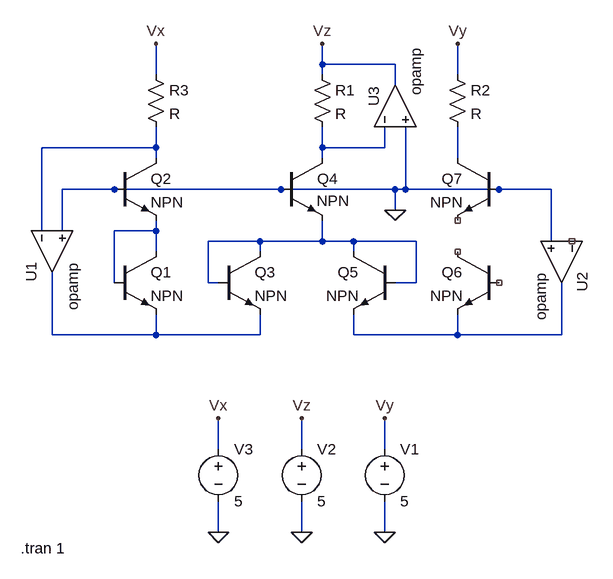
[diagram p0: schematic Draft1.asc]
Draft1.asc, the LTspice schematic file:
Version 4
SHEET 1 1040 680
WIRE 384 -240 384 -272
WIRE 496 -240 384 -240
WIRE 128 -224 128 -272
WIRE 384 -224 384 -240
WIRE 592 -224 592 -272
WIRE 496 -208 496 -240
WIRE 128 -112 128 -144
WIRE 128 -112 -48 -112
WIRE 384 -112 384 -144
WIRE 480 -112 480 -144
WIRE 480 -112 384 -112
WIRE 128 -96 128 -112
WIRE 384 -96 384 -112
WIRE 592 -96 592 -144
WIRE 64 -48 -16 -48
WIRE 320 -48 64 -48
WIRE 496 -48 320 -48
WIRE 512 -48 512 -144
WIRE 512 -48 496 -48
WIRE 656 -48 512 -48
WIRE 736 -48 656 -48
WIRE 496 -16 496 -48
WIRE -48 16 -48 -112
WIRE -16 16 -16 -48
WIRE 128 16 128 0
WIRE 128 16 64 16
WIRE 288 32 208 32
WIRE 384 32 384 0
WIRE 384 32 288 32
WIRE 432 32 384 32
WIRE 528 32 432 32
WIRE 736 32 736 -48
WIRE 128 48 128 16
WIRE 288 48 288 32
WIRE 432 48 432 32
WIRE 64 96 64 16
WIRE 208 96 208 32
WIRE 224 96 208 96
WIRE 528 96 528 32
WIRE 528 96 496 96
WIRE -32 176 -32 80
WIRE 128 176 128 144
WIRE 128 176 -32 176
WIRE 288 176 288 144
WIRE 288 176 128 176
WIRE 432 176 432 144
WIRE 592 176 592 144
WIRE 592 176 432 176
WIRE 752 176 752 96
WIRE 752 176 592 176
WIRE 224 352 224 304
WIRE 352 352 352 304
WIRE 480 352 480 304
WIRE 224 480 224 432
WIRE 352 480 352 432
WIRE 480 480 480 432
FLAG 496 -16 0
FLAG 352 304 Vz
FLAG 384 -272 Vz
FLAG 128 -272 Vx
FLAG 224 304 Vx
FLAG 480 304 Vy
FLAG 592 -272 Vy
FLAG 224 480 0
FLAG 352 480 0
FLAG 480 480 0
SYMBOL npn 64 48 R0
SYMATTR InstName Q1
SYMBOL npn 64 -96 R0
SYMATTR InstName Q2
SYMBOL npn 224 48 R0
SYMATTR InstName Q3
SYMBOL npn 320 -96 R0
WINDOW 3 55 66 Left 2
SYMATTR InstName Q4
SYMBOL npn 496 48 M0
SYMATTR InstName Q5
SYMBOL npn 656 48 M0
SYMATTR InstName Q6
SYMBOL npn 656 -96 M0
SYMATTR InstName Q7
SYMBOL Opamps\\opamp -96 48 M90
SYMATTR InstName U1
SYMBOL Opamps\\opamp 816 64 R90
SYMATTR InstName U2
SYMBOL Opamps\\opamp 432 -176 R270
WINDOW 0 -1 31 Left 2
SYMATTR InstName U3
SYMBOL res 368 -240 R0
SYMATTR InstName R1
SYMBOL res 576 -240 R0
SYMATTR InstName R2
SYMBOL res 112 -240 R0
SYMATTR InstName R3
SYMBOL voltage 480 336 R0
WINDOW 123 0 0 Left 2
WINDOW 39 0 0 Left 2
SYMATTR InstName V1
SYMATTR Value 5
SYMBOL voltage 352 336 R0
WINDOW 123 0 0 Left 2
WINDOW 39 0 0 Left 2
SYMATTR InstName V2
SYMATTR Value 5
SYMBOL voltage 224 336 R0
WINDOW 123 0 0 Left 2
WINDOW 39 0 0 Left 2
SYMATTR InstName V3
SYMATTR Value 5
TEXT -80 504 Left 2 !.tran 1

The netlist it stands for:
* Draft1.asc
Q1 N004 N004 N006 0 NPN
Q2 N001 0 N004 0 NPN
Q3 N005 N005 N006 0 NPN
Q4 N002 0 N005 0 NPN
Q5 N005 N005 N007 0 NPN
Q6 NC_01 NC_02 N007 0 NPN
Q7 N003 0 NC_03 0 NPN
XU1 N001 0 N006 opamp Aol=100K GBW=10Meg  ; pins invin noninvin out
XU2 NC_04 0 N007 opamp Aol=100K GBW=10Meg  ; pins invin noninvin out
XU3 N002 0 Vz opamp Aol=100K GBW=10Meg  ; pins invin noninvin out
R1 Vz N002 R
R2 Vy N003 R
R3 Vx N001 R
V1 Vy 0 5
V2 Vz 0 5
V3 Vx 0 5
.model NPN NPN
.model PNP PNP
.lib standard.bjt
.tran 1
.backanno
.end